# EAGLE schematic SchematicV7_Final (EAGLE 9.6.2)
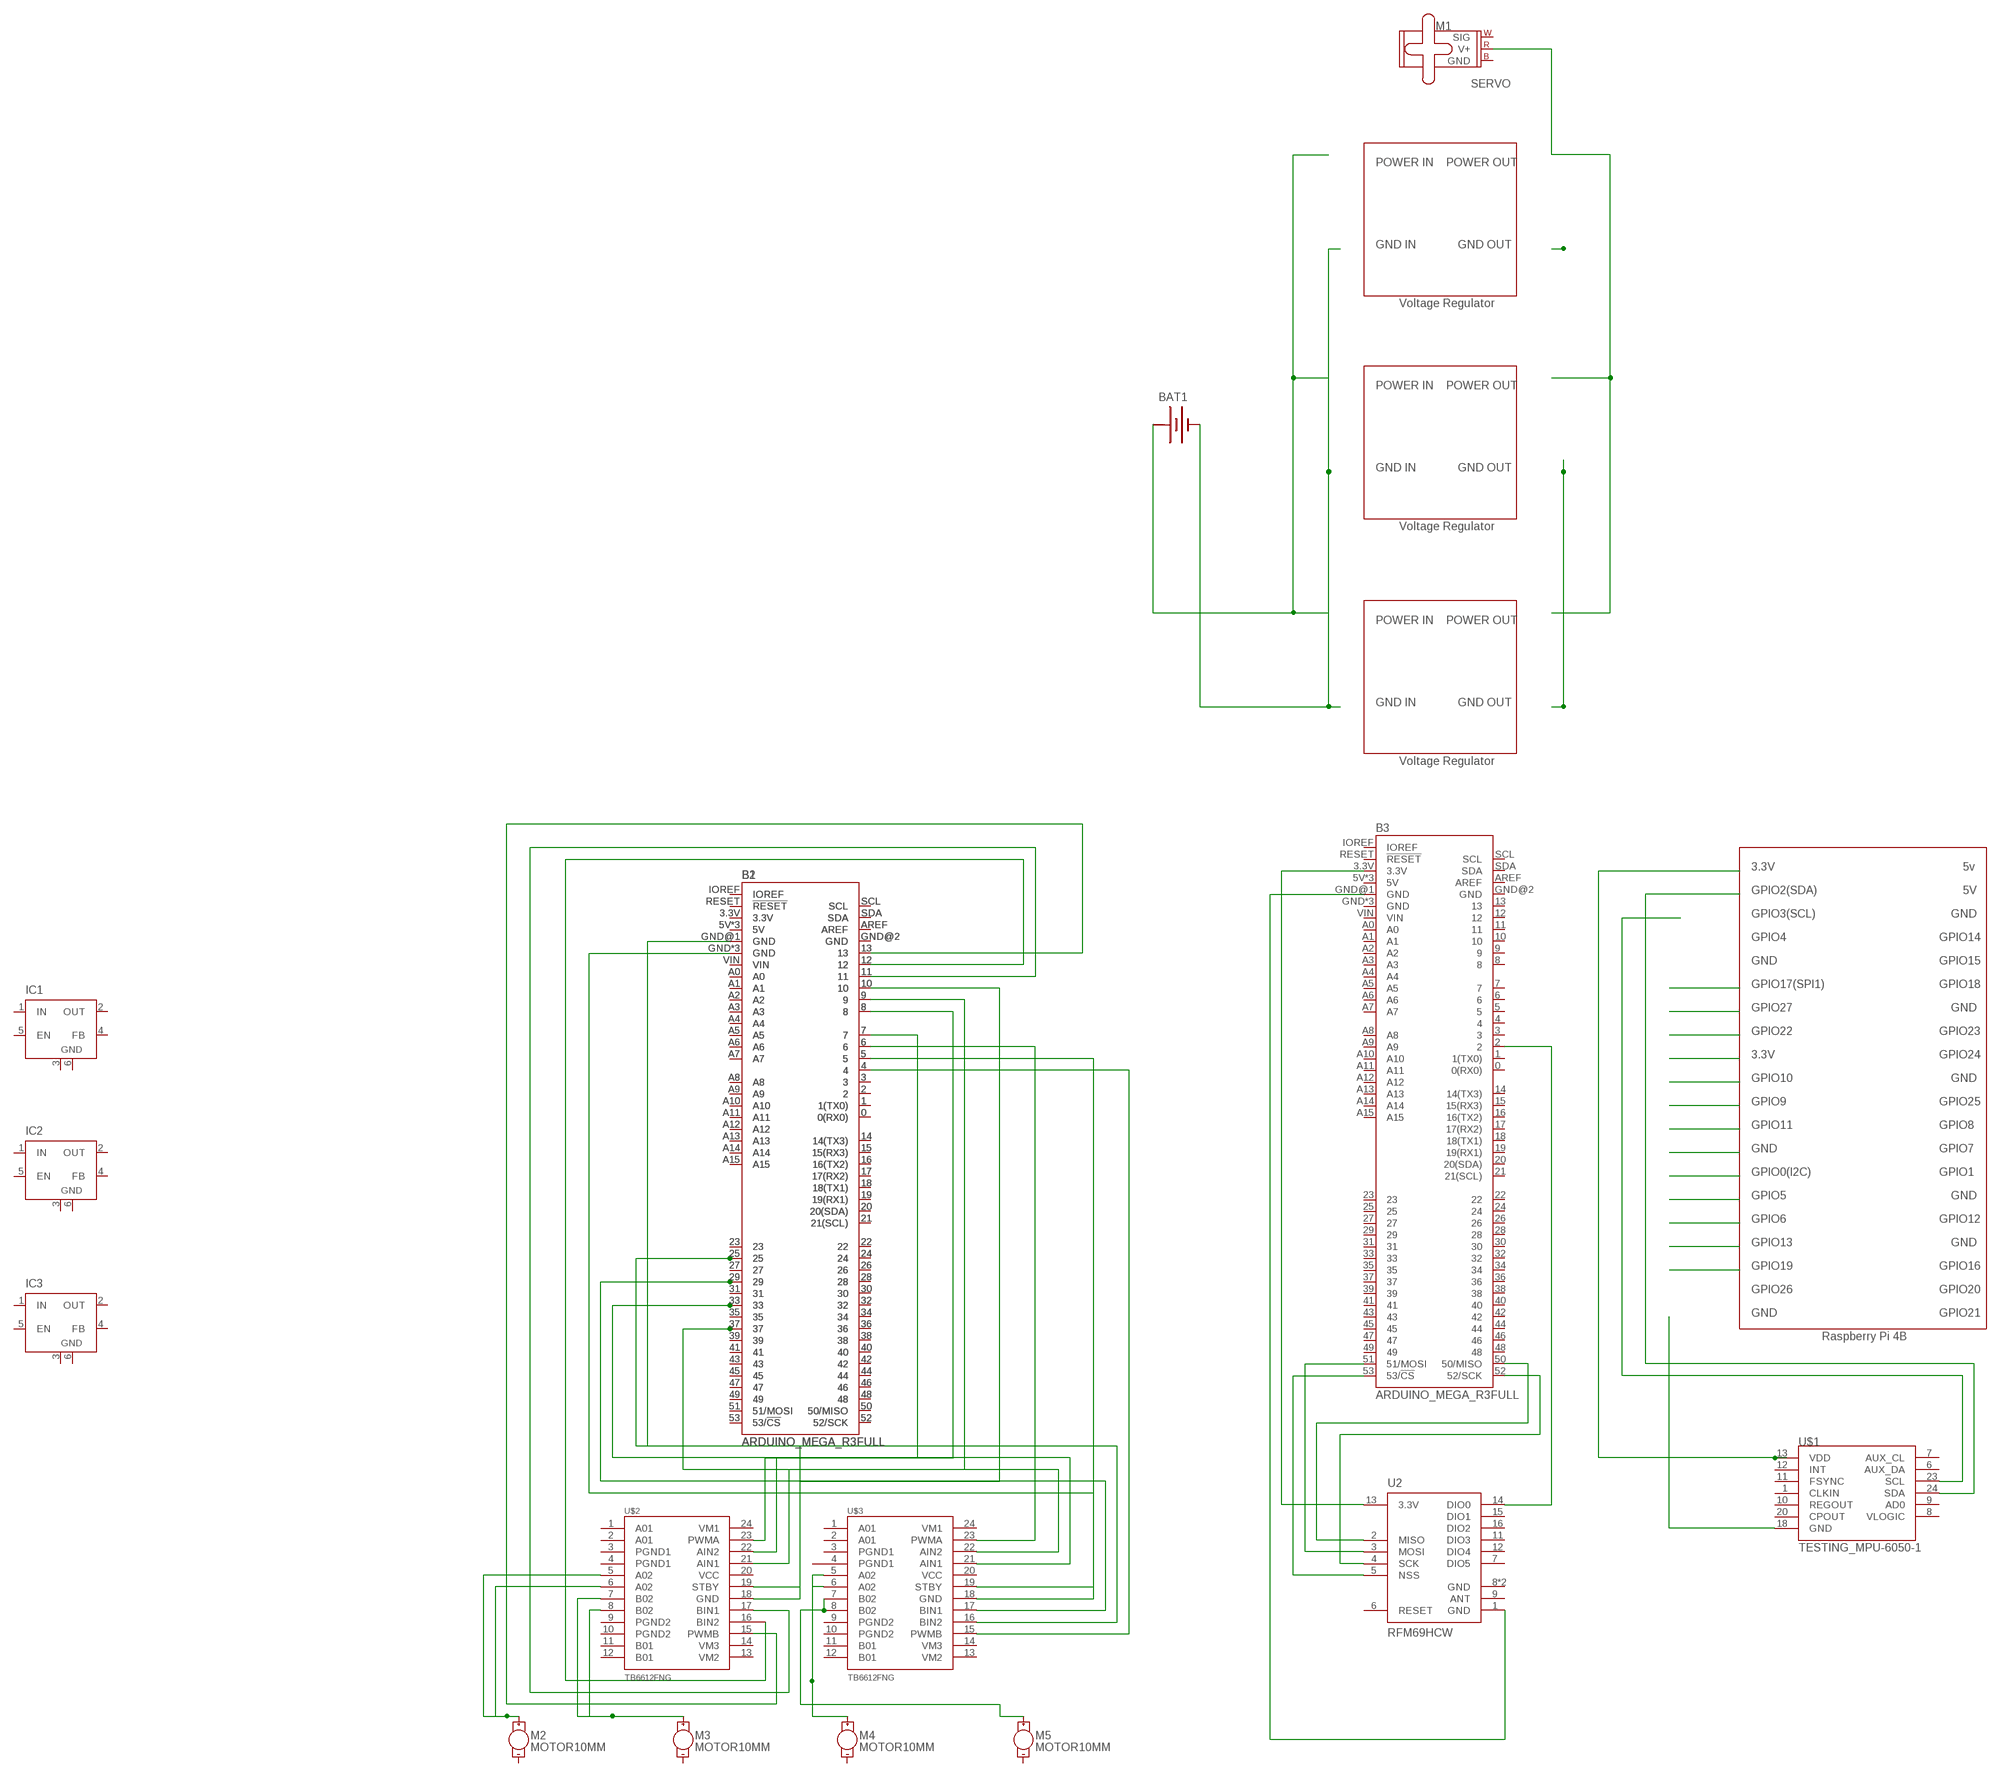
[diagram p0: schematic, sheet 1]

## Parts
B1  ARDUINO_MEGA_R3FULL  [ARDUINO_MEGA_NO_SILK]
B2  ARDUINO_MEGA_R3FULL  [ARDUINO_MEGA_NO_SILK]
B3  ARDUINO_MEGA_R3FULL  [ARDUINO_MEGA_NO_SILK]
BAT1  BATTERY  [BATTERY]
IC1  LM2596S  [TO263-5]
IC2  LM2596S  [TO263-5]
IC3  LM2596S  [TO263-5]
M1  SERVO  [1X03]
M2  MOTOR10MM  [VIBE-MOTOR-10MM]
M3  MOTOR10MM  [VIBE-MOTOR-10MM]
M4  MOTOR10MM  [VIBE-MOTOR-10MM]
M5  MOTOR10MM  [VIBE-MOTOR-10MM]
U2  RFM69HCW  [RFM69HCW-XXXS2]
U$1  TESTING_MPU-6050-1  [TESTING_QFN-24-4MM2]
U$2  TB6612FNG  [SSOP24]
U$3  TB6612FNG  [SSOP24]

## Nets
3.3V: U$1.13(VDD)
N$1: B1.9 B2.9 U$2.21(AIN1)
N$2: B1.8 B2.8 U$2.22(AIN2)
N$3: B1.7 B2.7 U$2.23(PWMA)
N$4: B1.10 B2.10 U$2.19(STBY)
N$5: B1.11 B2.11 U$2.17(BIN1)
N$7: B1.13 B2.13 U$2.15(PWMB)
N$8: B1.GND@1(GND) B2.GND@1(GND) U$2.18(GND)
N$9: M2.+ U$2.5(A02) U$2.6(A02)
N$10: B1.37 B2.37 U$3.22(AIN2)
N$11: M3.+ U$2.7(B02) U$2.8(B02)
N$13: B1.33 B2.33 U$3.21(AIN1)
N$14: B1.6 B2.6 U$3.23(PWMA)
N$15: B1.5 B2.5 U$3.19(STBY)
N$16: B1.29 B2.29 U$3.17(BIN1)
N$17: B1.25 B2.25 U$3.16(BIN2)
N$18: B1.4 B2.4 U$3.15(PWMB)
N$19: B1.GND B1.GND@3(GND) B1.GND@4(GND) B2.GND B2.GND@3(GND) B2.GND@4(GND) U$3.18(GND)
N$20: M4.+ U$3.5(A02) U$3.6(A02)
N$21: M5.+ U$3.7(B02) U$3.8(B02)
N$22: B1.12 B2.12
N$23: B1.5V B1.5V@1(5V) B1.5V@2(5V) B2.5V B2.5V@1(5V) B2.5V@2(5V)
N$24: B1.RESET(!RESET) B2.RESET(!RESET)
N$25: B1.A0 B2.A0
N$26: B1.A1 B2.A1
N$27: B1.A2 B2.A2
N$28: B1.A3 B2.A3
N$29: B1.A4 B2.A4
N$30: B1.A5 B2.A5
N$31: B1.A6 B2.A6
N$32: B1.A7 B2.A7
N$33: B1.A8 B2.A8
N$34: B1.A9 B2.A9
N$35: B1.A10 B2.A10
N$36: B1.A11 B2.A11
N$37: B1.A12 B2.A12
N$38: B1.A13 B2.A13
N$39: B1.A14 B2.A14
N$40: B1.A15 B2.A15
N$41: B1.1(1(TX0)) B2.1(1(TX0))
N$42: B1.2 B2.2
N$43: B1.3 B2.3
N$44: B1.16(16(TX2)) B2.16(16(TX2))
N$45: B1.17(17(RX2)) B2.17(17(RX2))
N$46: B1.18(18(TX1)) B2.18(18(TX1))
N$47: B1.22 B2.22
N$48: B1.23 B2.23
N$49: B1.24 B2.24
N$50: B1.26 B2.26
N$51: B1.27 B2.27
N$52: B1.28 B2.28
N$53: B1.30 B2.30
N$54: B1.31 B2.31
N$55: B1.32 B2.32
N$56: B1.34 B2.34
N$57: B1.35 B2.35
N$58: B1.36 B2.36
N$59: B1.38 B2.38
N$60: B1.40 B2.40
N$61: B1.39 B2.39
N$62: B1.41 B2.41
N$63: B1.42 B2.42
N$64: B1.43 B2.43
N$65: B1.44 B2.44
N$66: B1.45 B2.45
N$67: B1.46 B2.46
N$68: B1.47 B2.47
N$69: B1.48 B2.48
N$70: B1.15(15(RX3)) B2.15(15(RX3))
N$71: B1.14(14(TX3)) B2.14(14(TX3))
N$72: B1.53(53/!CS) B2.53(53/!CS)
N$73: B1.52(52/SCK) B2.52(52/SCK)
N$74: B1.51(51/MOSI) B2.51(51/MOSI)
N$75: B1.50(50/MISO) B2.50(50/MISO)
N$76: B1.49 B2.49
N$77: B1.3.3V B2.3.3V
N$78: B1.AREF B2.AREF
N$79: B1.21(21(SCL)) B2.21(21(SCL))
N$80: B1.20(20(SDA)) B2.20(20(SDA))
N$81: B1.19(19(RX1)) B2.19(19(RX1))
N$82: B1.VIN B2.VIN
N$83: B1.0(0(RX0)) B2.0(0(RX0))
N$84: B1.GND@2(GND) B2.GND@2(GND)
N$85: B1.SDA B2.SDA
N$86: B1.SCL B2.SCL
N$87: B1.IOREF B2.IOREF
N$88: B3.50(50/MISO) U2.2(MISO)
N$89: B3.51(51/MOSI) U2.3(MOSI)
N$90: B3.52(52/SCK) U2.4(SCK)
N$91: B3.53(53/!CS) U2.5(NSS)
N$92: B3.2 U2.14(DIO0)
N$93: B3.3.3V U2.13(3.3V)
N$94: B3.GND@1(GND) U2.1(GND)
N$95: U$1.24(SDA)
N$97: U$1.18(GND)
N$110: U$1.23(SCL)
N$111: BAT1.+
N$112: BAT1.-
N$113: M1.2(V+)
Unconnected: B3.0(0(RX0)) B3.1(1(TX0)) B3.3 B3.4 B3.5 B3.5V B3.5V@1(5V) B3.5V@2(5V) B3.6 B3.7 B3.8 B3.9 B3.10 B3.11 B3.12 B3.13 B3.14(14(TX3)) B3.15(15(RX3)) B3.16(16(TX2)) B3.17(17(RX2)) B3.18(18(TX1)) B3.19(19(RX1)) B3.20(20(SDA)) B3.21(21(SCL)) B3.22 B3.23 B3.24 B3.25 B3.26 B3.27 B3.28 B3.29 B3.30 B3.31 B3.32 B3.33 B3.34 B3.35 B3.36 B3.37 B3.38 B3.39 B3.40 B3.41 B3.42 B3.43 B3.44 B3.45 B3.46 B3.47 B3.48 B3.49 B3.A0 B3.A1 B3.A2 B3.A3 B3.A4 B3.A5 B3.A6 B3.A7 B3.A8 B3.A9 B3.A10 B3.A11 B3.A12 B3.A13 B3.A14 B3.A15 B3.AREF B3.GND B3.GND@2(GND) B3.GND@3(GND) B3.GND@4(GND) B3.IOREF B3.RESET(!RESET) B3.SCL B3.SDA B3.VIN IC1.1(IN) IC1.2(OUT) IC1.4(FB) IC1.5(EN) IC2.1(IN) IC2.2(OUT) IC2.4(FB) IC2.5(EN) IC3.1(IN) IC3.2(OUT) IC3.4(FB) IC3.5(EN) M1.1(SIG) M1.3(GND) M2.- M3.- M4.- M5.- U2.6(RESET) U2.7(DIO5) U2.9(ANT) U2.11(DIO3) U2.12(DIO4) U2.15(DIO1) U2.16(DIO2) U$1.1(CLKIN) U$1.6(AUX_DA) U$1.7(AUX_CL) U$1.8(VLOGIC) U$1.9(AD0) U$1.10(REGOUT) U$1.11(FSYNC) U$1.12(INT) U$1.20(CPOUT) U$2.1(A01) U$2.2(A01) U$2.3(PGND1) U$2.4(PGND1) U$2.9(PGND2) U$2.10(PGND2) U$2.11(B01) U$2.12(B01) U$2.13(VM2) U$2.14(VM3) U$2.16(BIN2) U$2.20(VCC) U$2.24(VM1) U$3.1(A01) U$3.2(A01) U$3.3(PGND1) U$3.4(PGND1) U$3.9(PGND2) U$3.10(PGND2) U$3.11(B01) U$3.12(B01) U$3.13(VM2) U$3.14(VM3) U$3.20(VCC) U$3.24(VM1)

## Notes on the sheet
- POWER IN | POWER OUT
- GND IN | GND OUT
- Voltage Regulator
- POWER IN | POWER OUT
- GND IN | GND OUT
- Voltage Regulator
- POWER IN | POWER OUT
- GND IN | GND OUT
- Voltage Regulator
- 3.3V | 5v
- GPIO2(SDA) | 5V
- GPIO3(SCL) | GND
- GPIO4 | GPIO14
- GND | GPIO15
- GPIO17(SPI1) | GPIO18
- GPIO27 | GND
- GPIO22 | GPIO23
- 3.3V | GPIO24
- GPIO10 | GND
- GPIO9 | GPIO25
- GPIO11 | GPIO8
- GND | GPIO7
- GPIO0(I2C) | GPIO1
- GPIO5 | GND
- GPIO6 | GPIO12
- GPIO13 | GND
- GPIO19 | GPIO16
- GPIO26 | GPIO20
- GND | GPIO21
- Raspberry Pi 4B

## Power pins joined to a net without a drawn wire
+: BAT1.+@1(+)
GND: IC1.3(GND) IC1.6(GND) IC2.3(GND) IC2.6(GND) IC3.3(GND) IC3.6(GND) U2.8(GND) U2.10(GND)

## Library data of the parts
B1-B3 = SparkFun-Boards:ARDUINO_MEGA_R3: Arduino Mega R3 ATmega2560 R3 compatible footprint. SparkFun Products: Arduino Mega 2560 R3 <https://www.sparkfun.com/products/11061>
BAT1 = special:BATTERY: BATTERY
IC1-IC3 = linear:LM2596S: STEP-DOWN VOLTAGE REGULATOR
M1 = SparkFun-Electromechanical:SERVO: Servo Motor 3-pin connector for a standard servo motor (voltage supply, ground, and control signal.) SparkFun Products Servo - Generic (Sub-Micro Size) <https://www.sparkfun.com/products/9065> (ROB-09065) Servo - Generic High Torque Continuous Rotation (Standard Size) <https://www.sparkfun.com/products/9347> (ROB-09347) Servo - Generic High Torque (Standard Size) <https://www.sparkfun.com/products/11965> (ROB-11965)
M2-M5 = SparkFun-Electromechanical:MOTOR: Motor (Single-Phase) Two-terminal, single-phase motors. SparkFun Products Vibration Motor <https://www.sparkfun.com/products/8449> (ROB-08449) Physical dimension and wire connections for this powerful vibration motor. Motor has a self adhesive backing.; PROD_ID: COMP-08572; SF_SKU: ROB-08449
U2 = mike-temp:RFM69H
U$1 = new_Triple_Axis_Accelerometer-Gyro_Breakout_-_MPU-6050_v12:TESTING_MPU-6050
U$2 U$3 = SparkFun-IC-Special-Function:TB6612FNG: Toshiba 1A dual motor driver IC-09363; PROD_ID: IC-09363

## Net classes
0 Default: width 0.203 mm